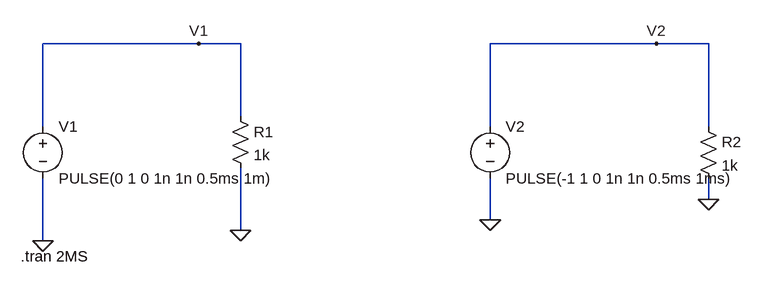
[diagram p0: schematic figure3.asc]
figure3.asc, the LTspice schematic file:
Version 4
SHEET 1 880 680
WIRE -304 0 -544 0
WIRE -240 0 -304 0
WIRE 400 0 144 0
WIRE 480 0 400 0
WIRE -240 112 -240 0
WIRE -544 128 -544 0
WIRE 144 128 144 0
WIRE 480 128 480 0
WIRE 480 240 480 208
WIRE 144 272 144 208
WIRE -240 288 -240 192
WIRE -544 304 -544 208
FLAG 144 272 0
FLAG 480 240 0
FLAG -240 288 0
FLAG -544 304 0
FLAG -304 0 V1
FLAG 400 0 V2
SYMBOL voltage -544 112 R0
WINDOW 123 0 0 Left 0
WINDOW 39 0 0 Left 0
SYMATTR InstName V1
SYMATTR Value PULSE(0 1 0 1n 1n 0.5ms 1m)
SYMBOL voltage 144 112 R0
WINDOW 123 0 0 Left 0
WINDOW 39 0 0 Left 0
SYMATTR InstName V2
SYMATTR Value PULSE(-1 1 0 1n 1n 0.5ms 1ms)
SYMBOL res -256 96 R0
SYMATTR InstName R1
SYMATTR Value 1k
SYMBOL res 464 112 R0
SYMATTR InstName R2
SYMATTR Value 1k
TEXT -578 328 Left 2 !.tran 2MS

The netlist it stands for:
* figure3.asc
V1 V1 0 PULSE(0 1 0 1n 1n 0.5ms 1m)
V2 V2 0 PULSE(-1 1 0 1n 1n 0.5ms 1ms)
R1 V1 0 1k
R2 V2 0 1k
.tran 2MS
.backanno
.end